# EAGLE design MJoy16-C1 (EAGLE 6.0)
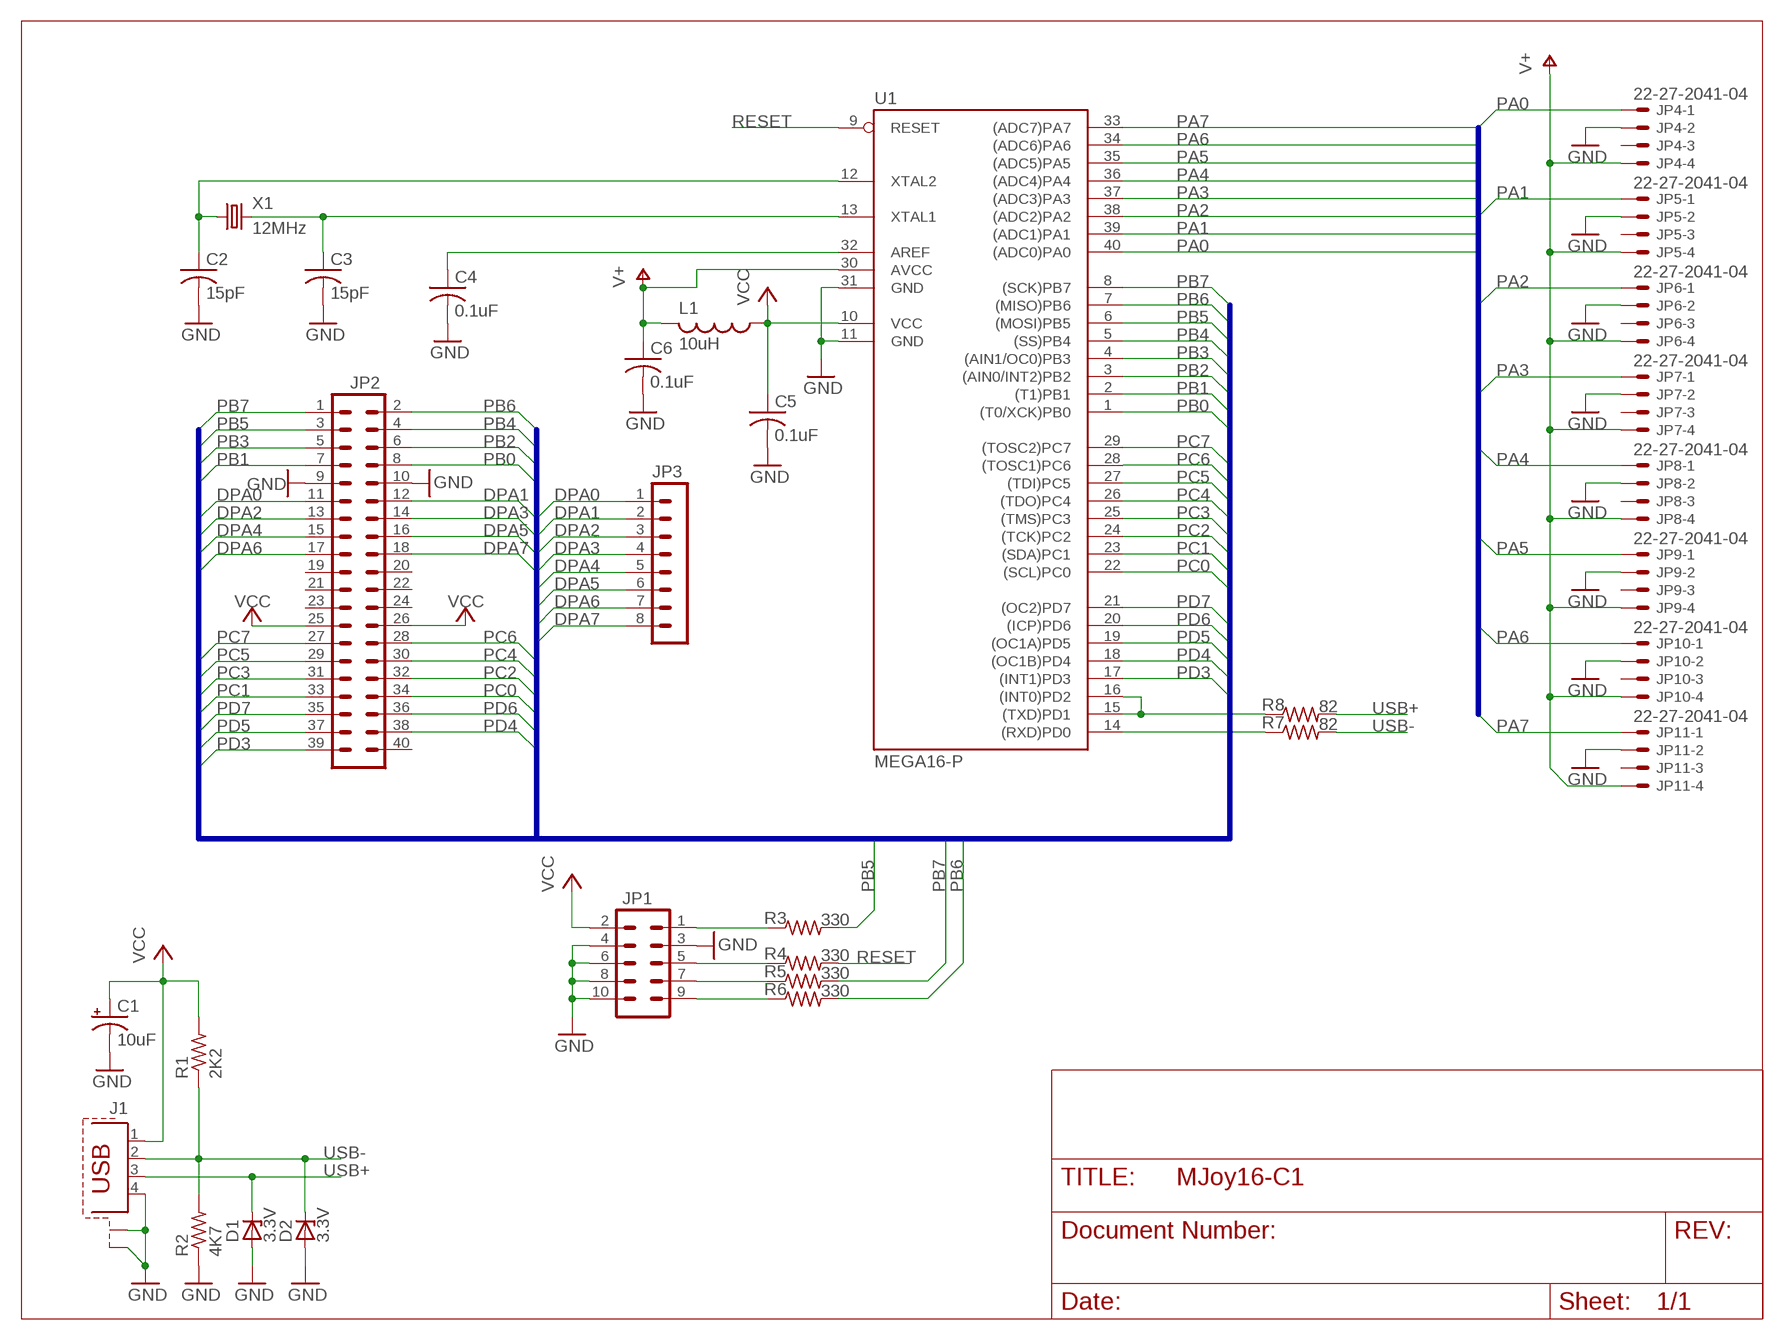
[diagram p0: schematic, sheet 1]

## Parts
C1  10uF  CPOL-USE2.5-5  [E2,5-5]
C2  15pF  C-US025-024X044  [C025-024X044]
C3  15pF  C-US025-024X044  [C025-024X044]
C4  0.1uF  C-US050-025X075  [C050-025X075]
C5  0.1uF  C-US050-025X075  [C050-025X075]
C6  0.1uF  C-US050-025X075  [C050-025X075]
D1  3.3V  ZENER-DIODEZD-5  [ZDIO-5]
D2  3.3V  ZENER-DIODEZD-5  [ZDIO-5]
J1  PN61729-S  [PN61729-S]
JP1  ML10  [ML10]
JP2  MA20-2  [MA20-2]
JP3  MA08-1  [MA08-1]
JP4  22-27-2041-04  [6410-04]
JP5  22-27-2041-04  [6410-04]
JP6  22-27-2041-04  [6410-04]
JP7  22-27-2041-04  [6410-04]
JP8  22-27-2041-04  [6410-04]
JP9  22-27-2041-04  [6410-04]
JP10  22-27-2041-04  [6410-04]
JP11  22-27-2041-04  [6410-04]
L1  10uH  L-US0207/7  [0207/7]
R1  2K2  R-US_0207/7  [0207/7]
R2  4K7  R-US_0207/7  [0207/7]
R3  330  R-US_0207/7  [0207/7]
R4  330  R-US_0207/7  [0207/7]
R5  330  R-US_0207/7  [0207/7]
R6  330  R-US_0207/7  [0207/7]
R7  82  R-US_0207/7  [0207/7]
R8  82  R-US_0207/7  [0207/7]
U1  MEGA16-P  [DIL40]
X1  12MHz  CRYSTALHC49U-V  [HC49U-V]

## Nets
DPA0: JP2.11 JP3.1
DPA1: JP2.12 JP3.2
DPA2: JP2.13 JP3.3
DPA3: JP2.14 JP3.4
DPA4: JP2.15 JP3.5
DPA5: JP2.16 JP3.6
DPA6: JP2.17 JP3.7
DPA7: JP2.18 JP3.8
GND: C1.- C2.2 C3.2 C4.2 C5.2 C6.2 D1.A D2.A J1.4 J1.S1 J1.S2 JP1.3 JP1.4 JP1.6 JP1.8 JP1.10 JP2.9 JP2.10 JP4.2 JP5.2 JP6.2 JP7.2 JP8.2 JP9.2 JP10.2 JP11.2 R2.1 U1.11(GND) U1.31(GND)
N$1: JP1.1 R3.1
N$2: JP1.5 R4.1
N$3: JP1.7 R5.1
N$4: JP1.9 R6.1
N$5: C3.1 U1.13(XTAL1) X1.2
N$6: C2.1 U1.12(XTAL2) X1.1
N$7: C4.1 U1.32(AREF)
N$9: R7.1 U1.14((RXD)PD0)
N$10: R8.1 U1.15((TXD)PD1) U1.16((INT0)PD2)
PA0: JP4.1 U1.40((ADC0)PA0)
PA1: JP5.1 U1.39((ADC1)PA1)
PA2: JP6.1 U1.38((ADC2)PA2)
PA3: JP7.1 U1.37((ADC3)PA3)
PA4: JP8.1 U1.36((ADC4)PA4)
PA5: JP9.1 U1.35((ADC5)PA5)
PA6: JP10.1 U1.34((ADC6)PA6)
PA7: JP11.1 U1.33((ADC7)PA7)
PB0: JP2.8 U1.1((T0/XCK)PB0)
PB1: JP2.7 U1.2((T1)PB1)
PB2: JP2.6 U1.3((AIN0/INT2)PB2)
PB3: JP2.5 U1.4((AIN1/OC0)PB3)
PB4: JP2.4 U1.5((SS)PB4)
PB5: JP2.3 R3.2 U1.6((MOSI)PB5)
PB6: JP2.2 R6.2 U1.7((MISO)PB6)
PB7: JP2.1 R5.2 U1.8((SCK)PB7)
PC0: JP2.34 U1.22((SCL)PC0)
PC1: JP2.33 U1.23((SDA)PC1)
PC2: JP2.32 U1.24((TCK)PC2)
PC3: JP2.31 U1.25((TMS)PC3)
PC4: JP2.30 U1.26((TDO)PC4)
PC5: JP2.29 U1.27((TDI)PC5)
PC6: JP2.28 U1.28((TOSC1)PC6)
PC7: JP2.27 U1.29((TOSC2)PC7)
PD3: JP2.39 U1.17((INT1)PD3)
PD4: JP2.38 U1.18((OC1B)PD4)
PD5: JP2.37 U1.19((OC1A)PD5)
PD6: JP2.36 U1.20((ICP)PD6)
PD7: JP2.35 U1.21((OC2)PD7)
RESET: R4.2 U1.9(RESET)
USB+: D1.C J1.3 R8.2
USB-: D2.C J1.2 R1.1 R2.2 R7.2
V+: C6.1 JP4.4 JP5.4 JP6.4 JP7.4 JP8.4 JP9.4 JP10.4 JP11.4 L1.2 U1.30(AVCC)
VCC: C1.+ C5.1 J1.1 JP1.2 JP2.25 JP2.26 L1.1 R1.2 U1.10(VCC)
Unconnected: JP2.19 JP2.20 JP2.21 JP2.22 JP2.23 JP2.24 JP2.40 JP4.3 JP5.3 JP6.3 JP7.3 JP8.3 JP9.3 JP10.3 JP11.3

## Buses
PA[0..7]
PB[0..7],PC[0..7],PD[3..7],DPA[0..7]

## Library data of the parts
C1 = rcl:CPOL-US: POLARIZED CAPACITOR, American symbol
C2-C6 = rcl:C-US: CAPACITOR, American symbol
D1 D2 = diode:ZENER-DIODE: Z-Diode
J1 = con-berg:PN61729-S: BERG USB connector; OC_FARNELL: unknown; OC_NEWARK: unknown
JP1 = con-ml:ML10: HARTING; OC_FARNELL: unknown; OC_NEWARK: unknown
JP2 = con-lstb:MA20-2: PIN HEADER; OC_FARNELL: unknown; OC_NEWARK: unknown
JP3 = con-lstb:MA08-1: PIN HEADER; OC_FARNELL: unknown; OC_NEWARK: unknown
JP4-JP11 = con-molex:22-?-04: CONNECTOR wire to board 2.54 mm (.1 inch) pitch header; OC_FARNELL: unknown; OC_NEWARK: unknown
L1 = rcl:L-US: INDUCTOR, American symbol
R1-R8 = resistor:R-US_: RESISTOR, American symbol
U1 = atmel:MEGA16-P: MICROCONTROLLER 16 Kbytes FLASH 1 kbytes SRAM 512 bytes EEPROM USART 8-channel 10 bit ADC Source: avr.lbr; MPN: ATMEGA16-16PU; OC_FARNELL: 9171142; OC_NEWARK: 01M6885
X1 = crystal:CRYSTAL: CRYSTAL; OC_FARNELL: 1666969; OC_NEWARK: unknown

## Board
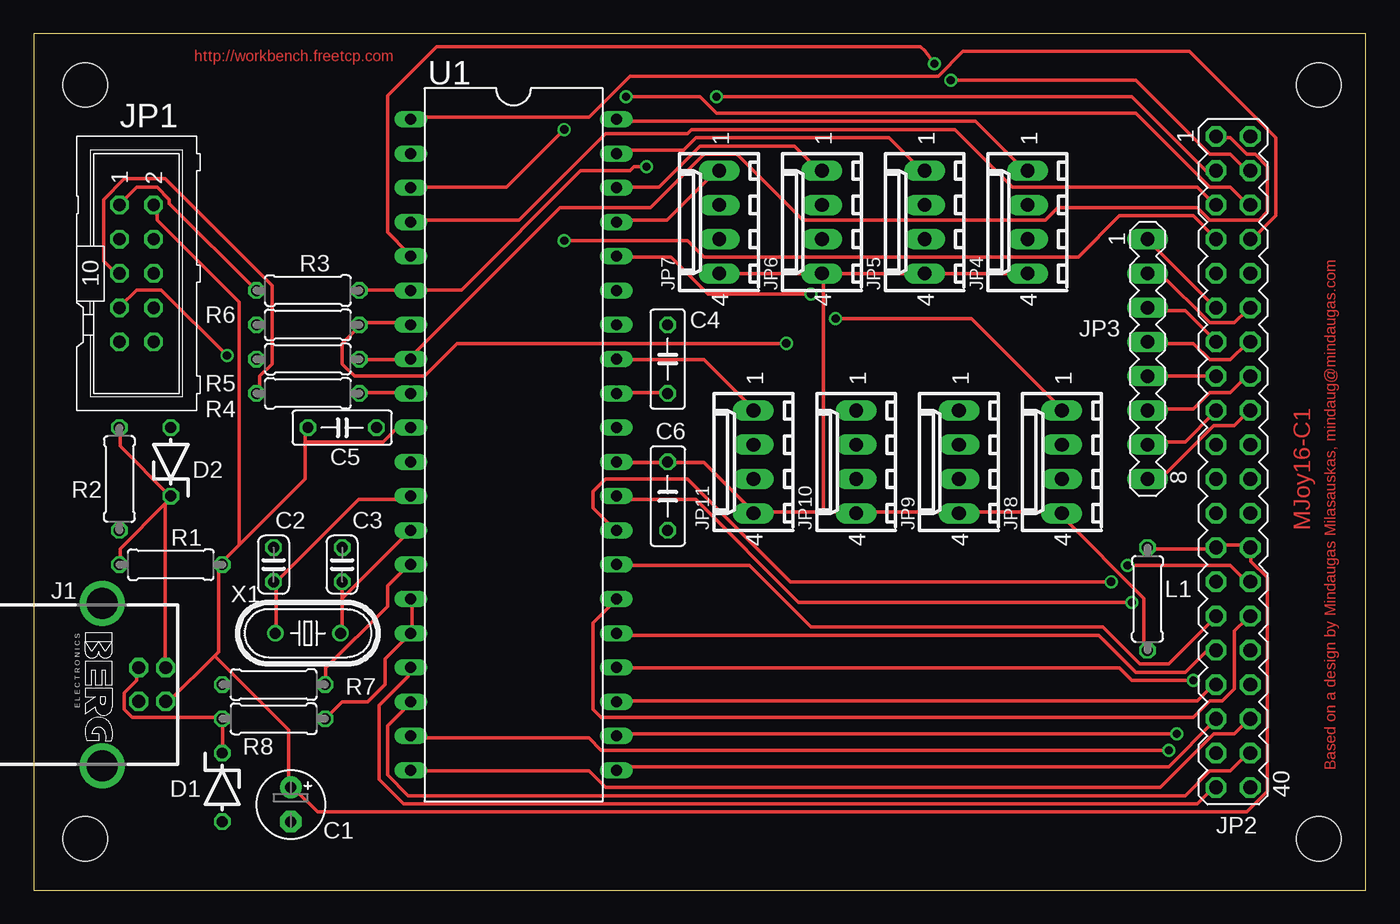
[diagram p1: board, top side]
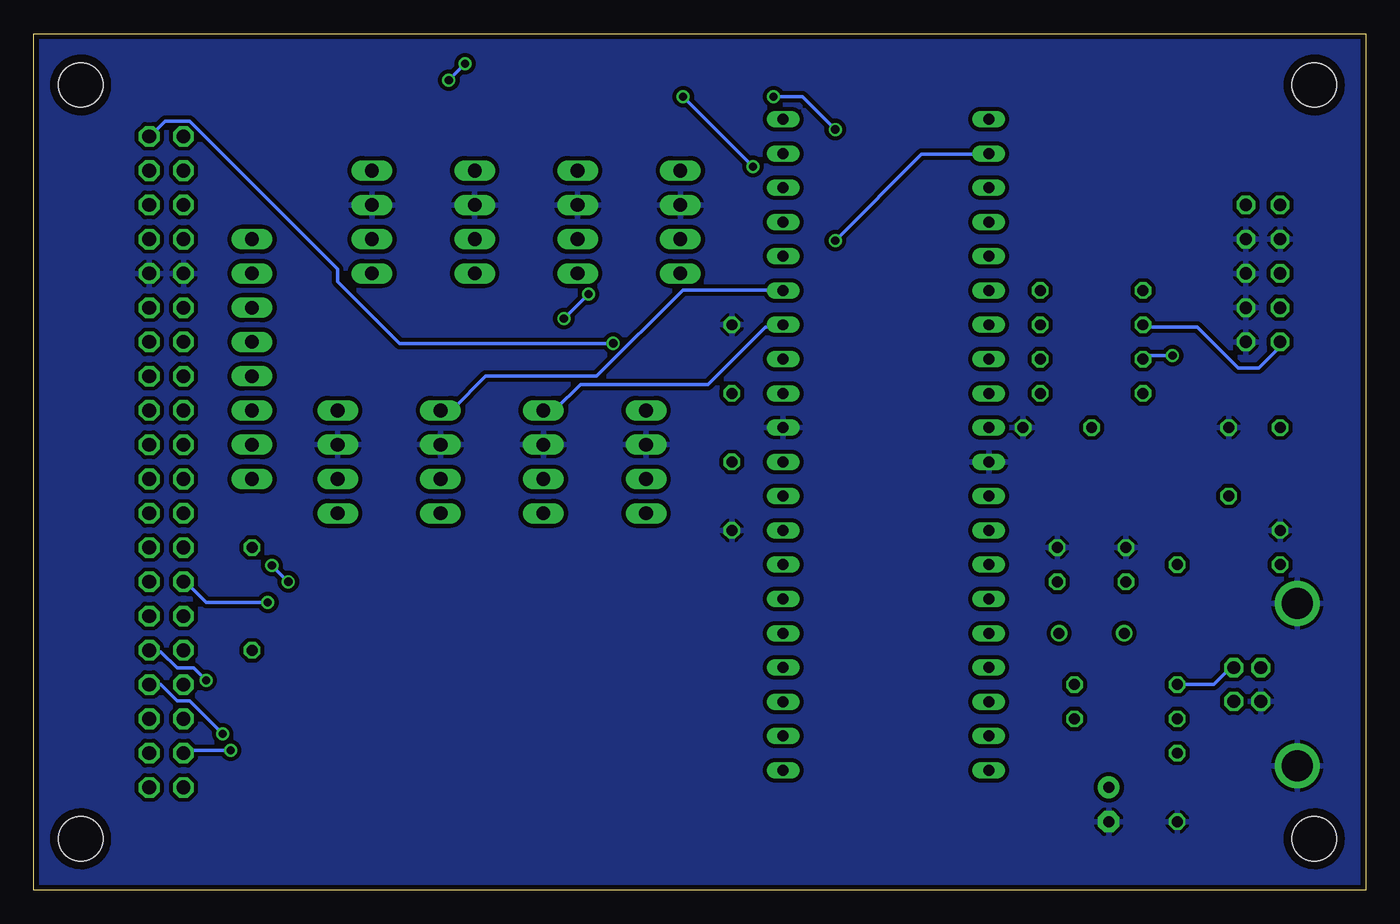
[diagram p2: board, bottom side, seen from below]

Size 98.73 x 63.49 mm. Coordinates in mm from the lower left corner, seen from the top.
Outline: 0,0 98.73,0 98.73,63.49 0,63.49 0,0
Copper layers (1*16): Top 0.0356mm / dielectric 1.5011mm / Bottom 0.0356mm
Design rules: minimum track width 6mil, minimum drill 13mil, track to track 6mil, track to pad 6mil, pad to pad 6mil, via to via 6mil, smd to smd 6mil, copper to edge 15mil, drill to drill 6mil, minimum pad ring 7mil, minimum via ring 7mil, stop-mask expansion 4mil, vias tented up to drill 0mil, thermal gap 10mil

### Footprints (pad centres in the part's own frame; a part is rotated, then mirrored left to right if it is on the bottom)
E2,5-5 = drill 0.813 pad 1.6: + -1.27,0 | drill 0.813 pad 1.6 octagon: - 1.27,0
C025-024X044 = drill 0.813 octagon: 1 -1.27,0; 2 1.27,0
C050-025X075 = drill 0.813 octagon: 1 -2.54,0; 2 2.54,0
ZDIO-5 = drill 0.813 octagon: A 2.54,0; C -2.54,0
PN61729-S = drill 0.95 octagon: 1 1.25,4.71; 2 -1.25,4.71; 3 -1.25,2.71; 4 1.25,2.71 | drill 2.3 pad 2.9: S1 -6.02,0; S2 6.02,0
ML10 = drill 0.914 octagon: 1 -5.08,-1.27; 2 -5.08,1.27; 3 -2.54,-1.27; 4 -2.54,1.27; 5 0,-1.27; 6 0,1.27; 7 2.54,-1.27; 8 2.54,1.27; 9 5.08,-1.27; 10 5.08,1.27
MA20-2 = drill 1.016 octagon: 1 -24.13,-1.27; 2 -24.13,1.27; 3 -21.59,-1.27; 4 -21.59,1.27; 5 -19.05,-1.27; 6 -19.05,1.27; 7 -16.51,-1.27; 8 -16.51,1.27; 9 -13.97,-1.27; 10 -13.97,1.27; 11 -11.43,-1.27; 12 -11.43,1.27; 13 -8.89,-1.27; 14 -8.89,1.27; 15 -6.35,-1.27; 16 -6.35,1.27; 17 -3.81,-1.27; 18 -3.81,1.27; 19 -1.27,-1.27; 20 -1.27,1.27; 21 1.27,-1.27; 22 1.27,1.27; 23 3.81,-1.27; 24 3.81,1.27; 25 6.35,-1.27; 26 6.35,1.27; 27 8.89,-1.27; 28 8.89,1.27; 29 11.43,-1.27; 30 11.43,1.27; 31 13.97,-1.27; 32 13.97,1.27; 33 16.51,-1.27; 34 16.51,1.27; 35 19.05,-1.27; 36 19.05,1.27; 37 21.59,-1.27; 38 21.59,1.27; 39 24.13,-1.27; 40 24.13,1.27
MA08-1 = drill 1.016 long: 1 -8.89,0; 2 -6.35,0; 3 -3.81,0; 4 -1.27,0; 5 1.27,0; 6 3.81,0; 7 6.35,0; 8 8.89,0
6410-04 = drill 1.016 long: 1 3.81,0; 2 1.27,0; 3 -1.27,0; 4 -3.81,0
0207/7 = drill 0.813 octagon: 1 -3.81,0; 2 3.81,0
DIL40 = drill 0.813 long: 1 -24.13,-7.62; 2 -21.59,-7.62; 3 -19.05,-7.62; 4 -16.51,-7.62; 5 -13.97,-7.62; 6 -11.43,-7.62; 7 -8.89,-7.62; 8 -6.35,-7.62; 9 -3.81,-7.62; 10 -1.27,-7.62; 11 1.27,-7.62; 12 3.81,-7.62; 13 6.35,-7.62; 14 8.89,-7.62; 15 11.43,-7.62; 16 13.97,-7.62; 17 16.51,-7.62; 18 19.05,-7.62; 19 21.59,-7.62; 20 24.13,-7.62; 21 24.13,7.62; 22 21.59,7.62; 23 19.05,7.62; 24 16.51,7.62; 25 13.97,7.62; 26 11.43,7.62; 27 8.89,7.62; 28 6.35,7.62; 29 3.81,7.62; 30 1.27,7.62; 31 -1.27,7.62; 32 -3.81,7.62; 33 -6.35,7.62; 34 -8.89,7.62; 35 -11.43,7.62; 36 -13.97,7.62; 37 -16.51,7.62; 38 -19.05,7.62; 39 -21.59,7.62; 40 -24.13,7.62
STAND-OFF = hole 3.302: 0,0
HC49U-V = drill 0.813: 1 -2.413,0; 2 2.413,0

### Placement (x,y rotation side)
C1  19.05,6.35 270 top
C2  17.78,24.13 90 top
C3  22.86,24.13 90 top
C4  46.99,39.37 90 top
C5  22.86,34.29 0 top
C6  46.99,29.21 270 top
D1  13.97,7.62 270 top
D2  10.16,31.75 90 top
J1  5.08,15.24 270 top
JP1  7.62,45.72 270 top
JP2  88.9,31.75 270 top
JP3  82.55,39.37 270 top
JP4  73.66,49.53 90 top
JP5  66.04,49.53 90 top
JP6  58.42,49.53 90 top
JP7  50.8,49.53 90 top
JP8  76.2,31.75 90 top
JP9  68.58,31.75 90 top
JP10  60.96,31.75 90 top
JP11  53.34,31.75 90 top
L1  82.55,21.59 270 top
R1  10.16,24.13 0 top
R2  6.35,30.48 90 top
R3  20.32,44.45 0 top
R4  20.32,36.83 0 top
R5  20.32,39.37 0 top
R6  20.32,41.91 0 top
R7  17.78,15.24 180 top
R8  17.78,12.7 180 top
U1  35.56,33.02 270 top
U$1  [STAND-OFF]  3.81,3.81 0 top
U$2  [STAND-OFF]  3.81,59.69 0 top
U$3  [STAND-OFF]  95.25,59.69 0 top
U$4  [STAND-OFF]  95.25,3.81 0 top
X1  20.32,19.05 0 top

### Tracks (layer width: path | path; a pad name or v marks a point on that pad's centre or on a via)
DPA0
  Top 0.254: JP3.1 82.6,48.16 87.48,43.28 JP2.11
DPA1
  Top 0.254: JP3.2 83.52,45.72 87.17,42.06 89,42.06 89.92,42.98 JP2.12
DPA2
  Top 0.254: JP3.3 82.6,42.98 85.34,42.98 87.48,40.84 JP2.13
DPA3
  Top 0.254: JP3.4 82.6,40.54 85.95,40.54 87.17,39.32 88.7,39.32 89.92,40.54 JP2.14
DPA4
  Top 0.254: JP2.15 JP3.5
DPA5
  Top 0.254: JP3.6 82.6,35.66 85.95,35.66 87.17,36.88 88.7,36.88 89.92,38.1 JP2.16
DPA6
  Top 0.254: JP3.7 82.6,33.22 85.34,33.22 87.48,35.36 JP2.17
DPA7
  Top 0.254: JP3.8 83.52,30.48 87.48,34.44 89,34.44 89.92,35.36 JP2.18
GND
  pour Bottom (isolate 0.305): 0,63.5 98.42,63.5 98.42,0 0,0
N$1
  Top 0.254: R3.1 10.06,50.9 10.06,51.21 9.14,52.12 7.62,52.12 6.4,50.9 JP1.1
N$2
  Top 0.254: R4.1 16.76,36.88 16.76,38.1 17.68,39.01 17.68,44.81 9.75,52.73 6.71,52.73 5.18,51.21 5.18,46.63 6.1,45.72 JP1.5
N$3  (via drill 0.61)
  Top 0.254: v14.33,39.62 9.45,44.5 7.62,44.5 6.4,43.28 JP1.7
  Bottom 0.254: v14.33,39.62 16.46,39.62 R5.1
N$4
  Bottom 0.254: R6.1 16.46,41.76 12.5,41.76 9.45,38.71 7.92,38.71 6.1,40.54 JP1.9
N$5
  Top 0.254: C3.1 22.86,21.64 | 22.86,21.64 22.86,19.2 X1.2 | 22.86,21.64 27.74,26.52 U1.13
N$6
  Top 0.254: 17.98,22.86 17.98,19.2 X1.1 | 17.98,22.86 24.08,28.96 27.74,28.96 U1.12 | 17.98,22.86 C2.1
N$7
  Top 0.254: U1.32 43.28,36.88 46.94,36.88 C4.1
N$9
  Top 0.254: R7.1 21.64,15.24 21.64,16.46 26.21,21.03 26.21,22.55 27.74,24.08 U1.14
N$10
  Top 0.254: U1.15 28.04,21.34 28.04,19.2 U1.16 26.04,17.14 26.04,15.24 24.77,13.97 22.86,13.97 R8.1
PA0
  Top 0.254: U1.40 43.28,57 69.8,57 73.46,53.34 JP4.1
PA1
  Top 0.254: U1.39 43.28,54.86 48.16,54.86 49.07,55.78 63.4,55.78 65.84,53.34 JP5.1
PA2
  Top 0.254: U1.38 43.28,52.12 46.33,52.12 49.38,55.17 56.39,55.17 58.22,53.34 JP6.1
PA3
  Top 0.254: U1.37 43.28,49.68 46.94,49.68 50.6,53.34 JP7.1
PA4  (via drill 0.61)
  Top 0.254: v57.61,44.2 49.99,44.2 47.24,46.94 43.28,46.94 U1.36 | v59.44,42.37 69.49,42.37 76.2,35.66 JP8.1
  Bottom 0.254: v59.44,42.37 v57.61,44.2
PA5
  Bottom 0.254: U1.35 43.28,44.5 50.6,44.5 57,38.1 65.23,38.1 67.67,35.66 68.58,35.66 JP9.1
PA6
  Bottom 0.254: U1.34 43.28,41.76 44.5,41.76 48.77,37.49 58.22,37.49 60.05,35.66 60.96,35.66 JP10.1
PA7
  Top 0.254: U1.33 43.28,39.32 49.68,39.32 53.34,35.66 JP11.1
PB0
  Top 0.254: U1.1 28.04,57.3 41.15,57.3 44.2,60.35 67.06,60.35 68.89,62.18 85.65,62.18 92.05,55.78 92.05,49.99 90.22,48.16 JP2.8
PB1  (via drill 0.61)
  Top 0.254: v39.32,48.16 48.46,48.16 49.68,46.94 77.42,46.94 80.47,49.99 85.95,49.99 87.48,48.46 JP2.7
  Bottom 0.254: v39.32,48.16 32.92,54.56 28.04,54.56 U1.2
PB2  (via drill 0.61)
  Top 0.254: v39.32,56.39 35.05,52.12 28.04,52.12 U1.3 | v43.89,58.83 49.38,58.83 50.6,57.61 81.69,57.61 87.17,52.12 88.7,52.12 89.92,50.9 JP2.6
  Bottom 0.254: v39.32,56.39 41.76,58.83 v43.89,58.83
PB3
  Top 0.254: U1.4 28.04,49.68 35.97,49.68 42.37,56.08 48.46,56.08 48.77,56.39 68.28,56.39 72.54,52.12 86.26,52.12 87.48,50.9 JP2.5
PB4  (via drill 0.61)
  Top 0.254: v66.75,61.27 66.04,62.23 65.73,62.53 29.87,62.53 26.21,58.88 26.21,48.77 27.74,47.24 U1.5 | v67.97,60.05 81.69,60.05 87.17,54.56 88.7,54.56 89.92,53.34 JP2.4
  Bottom 0.254: v67.97,60.05 v66.75,61.27
PB5  (via drill 0.61)
  Top 0.254: R3.2 24.38,44.5 27.74,44.5 U1.6 28.04,44.5 31.7,44.5 40.54,53.34 44.2,53.34 44.5,53.65 v45.41,53.65 | JP2.3 86.87,53.34 81.38,58.83 v50.6,58.83
  Bottom 0.254: v45.41,53.65 v50.6,58.83
PB6  (via drill 0.61)
  Top 0.254: U1.7 27.74,42.06 24.38,42.06 R6.2 24.08,41.76 22.86,40.54 22.86,39.01 23.77,38.1 28.96,38.1 31.39,40.54 v55.78,40.54
  Bottom 0.254: v55.78,40.54 71.63,40.54 76.2,45.11 76.2,46.02 87.17,57 89,57 89.92,56.08 JP2.2
PB7
  Top 0.254: R5.2 24.38,39.32 27.74,39.32 U1.8 28.04,39.62 39.01,50.6 45.72,50.6 49.68,54.56 52.12,54.56 57,49.68 74.98,49.68 75.89,50.6 86.26,50.6 87.17,49.68 90.83,49.68 91.44,50.29 91.44,53.65 90.53,54.56 89.92,54.56 88.7,55.78 87.78,55.78 JP2.1
PC0  (via drill 0.61)
  Top 0.254: v84.73,11.58 43.28,11.58 U1.22
  Bottom 0.254: v84.73,11.58 87.17,14.02 88.09,14.02 89.31,15.24 JP2.34
PC1
  Top 0.254: U1.23 43.28,14.02 86.26,14.02 87.48,15.24 JP2.33
PC2  (via drill 0.61)
  Top 0.254: v85.95,15.54 81.38,15.54 80.47,16.46 43.28,16.46 U1.24
  Bottom 0.254: v85.95,15.54 86.87,16.46 88.09,16.46 89.31,17.68 89.92,17.68 JP2.32
PC3
  Top 0.254: U1.25 43.28,18.9 78.94,18.9 81.69,16.15 85.34,16.15 86.87,17.68 87.48,17.68 JP2.31
PC4
  Top 0.254: U1.26 42.98,21.34 41.45,19.81 41.45,13.41 42.06,12.8 85.95,12.8 87.17,14.02 88.09,14.02 89,14.94 89,19.2 89.92,20.12 JP2.30
PC5
  Top 0.254: U1.27 43.28,24.08 53.03,24.08 57.61,19.51 79.25,19.51 81.99,16.76 84.12,16.76 87.48,20.12 JP2.29
PC6  (via drill 0.61)
  Top 0.254: v79.86,22.86 56.08,22.86 48.46,30.48 42.37,30.48 41.45,29.57 41.45,28.35 42.98,26.82 U1.28 | v81.08,24.08 88.7,24.08 89.92,22.86 JP2.28
  Bottom 0.254: v81.08,24.08 v79.86,22.86
PC7  (via drill 0.61)
  Top 0.254: v81.38,21.34 56.69,21.34 49.07,28.96 43.28,28.96 U1.29
  Bottom 0.254: v81.38,21.34 85.95,21.34 87.48,22.86 JP2.27
PD3
  Top 0.254: U1.17 27.74,16.46 27.74,15.85 25.6,13.72 25.6,8.23 27.43,6.4 86.26,6.4 87.48,7.62 JP2.39
PD4
  Top 0.254: U1.18 27.74,13.72 26.21,12.19 26.21,8.53 27.74,7.01 85.34,7.01 87.17,8.84 88.7,8.84 89.92,10.06 JP2.38
PD5  (via drill 0.61)
  Top 0.254: v84.12,10.36 42.06,10.36 41.15,11.28 28.04,11.28 U1.19
  Bottom 0.254: v84.12,10.36 87.48,10.36 JP2.37
PD6
  Top 0.254: U1.20 28.04,8.84 41.15,8.84 42.37,7.62 83.52,7.62 87.48,11.58 89,11.58 89.92,12.5 JP2.36
PD7
  Top 0.254: U1.21 43.28,9.14 84.12,9.14 87.48,12.5 JP2.35
RESET
  Top 0.254: R4.2 24.38,36.88 27.74,36.88 U1.9
USB+
  Top 0.254: D1.C 14.02,10.36 14.02,12.5 R8.2 13.72,12.8 7.32,12.8 6.71,13.41 6.71,14.63 7.62,15.54 7.62,16.46 J1.3
USB-
  Top 0.254: 9.75,28.65 10.06,28.96 D2.C 10.06,29.26 6.4,32.92 6.4,34.14 R2.2 | 9.75,28.65 6.4,25.3 6.4,24.38 R1.1 | 9.75,28.65 9.75,16.76 J1.2
  Bottom 0.254: R7.2 11.28,15.24 10.06,16.46 J1.2
V+
  Top 0.254: JP7.4 JP6.4 58.52,45.72 | JP4.4 JP5.4 58.52,45.72 | L1.2 82.3,17.98 82.3,21.64 76.2,27.74 JP8.4 76.2,28.04 68.58,28.04 | U1.30 43.28,31.7 46.94,31.7 C6.1 47.24,31.7 49.68,31.7 53.34,28.04 | 60.96,28.04 58.52,28.04 | 58.52,28.04 53.34,28.04 | 60.96,28.04 68.58,28.04 | 60.96,28.04 JP10.4 | 53.34,28.04 JP11.4 | 68.58,28.04 JP9.4 | 58.52,28.04 58.52,45.72
VCC
  Top 0.254: L1.1 82.6,25.3 87.48,25.3 JP2.25 87.78,25.6 89.92,25.6 JP2.26 90.22,25.3 90.22,24.38 91.44,23.16 91.44,7.32 89.92,5.79 21.03,5.79 19.2,7.62 C1.+ 18.9,7.62 18.9,11.89 13.41,17.37 | 13.41,17.37 10.06,14.02 J1.1 | 13.41,17.37 13.72,17.68 13.72,24.08 R1.2 14.02,24.38 15.24,25.6 | 20.12,33.22 20.12,30.48 15.24,25.6 | 20.12,33.22 20.12,34.14 C5.1 | 20.12,33.22 25.91,33.22 26.82,34.14 27.74,34.14 U1.10 | 15.24,25.6 15.24,43.59 9.14,49.68 9.14,50.6 JP1.2

### Text on the board
Top: http://workbench.freetcp.com | MJoy16-C1 | Based on a design by Mindaugas Milasauskas, mindaug@mindaugas.com